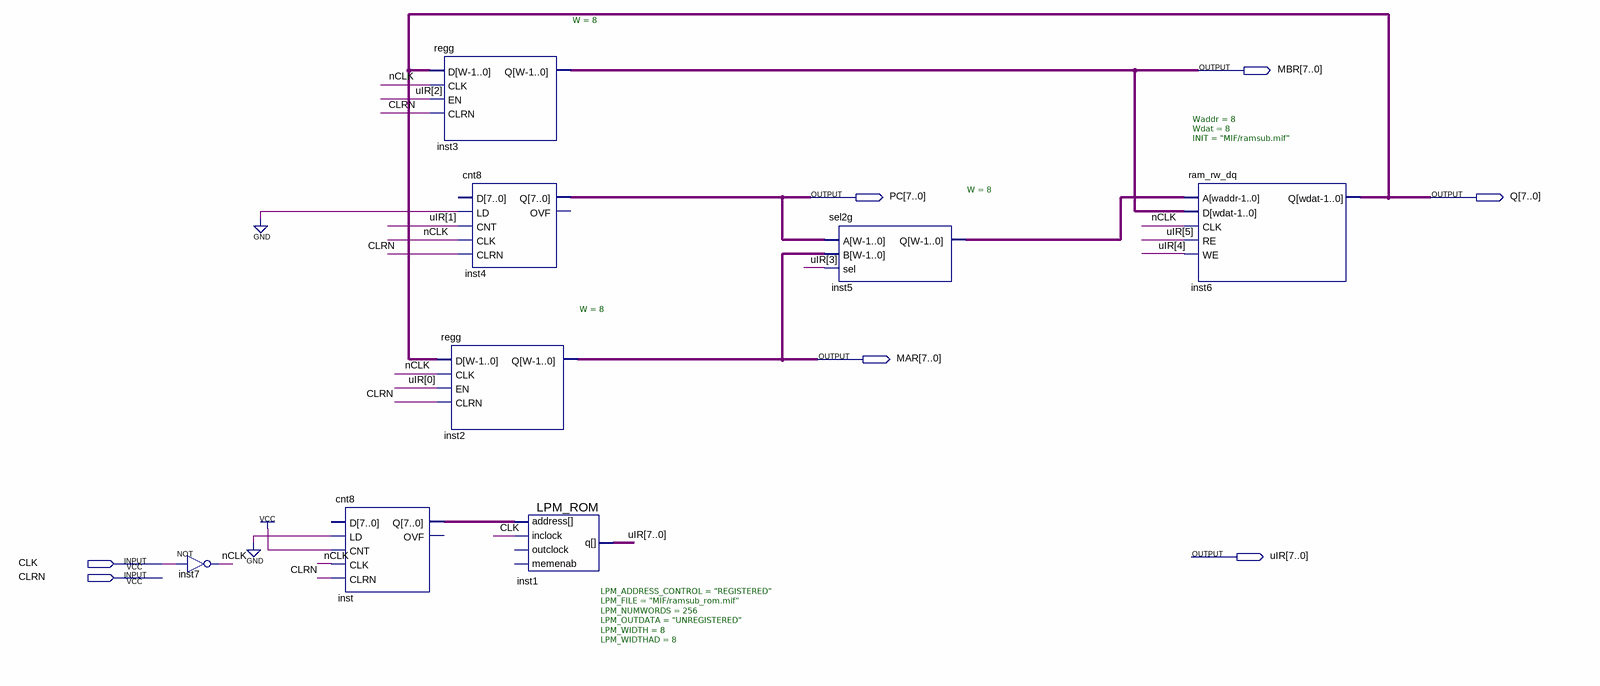
[diagram p0: schematic sheet]
// Quartus schematic ramsub.bdf as structural Verilog: 8 symbols, 7 pins
module ramsub (
  input  CLK,
  input  CLRN,
  output [7:0] MBR,
  output [7:0] PC,
  output [7:0] Q,
  output [7:0] MAR,
  output [7:0] uIR
);

  wire nCLK;
  wire [7:0] inst5_q, inst_q;

  not inst7 (nCLK, CLK);
  cnt8 inst (.LD(1'b0), .CNT(1'b1), .CLK(nCLK), .CLRN(CLRN), .Q(inst_q));  // open: D, OVF
  regg #(.W(8)) inst3 (.D(Q), .CLK(nCLK), .EN(uIR[2]), .CLRN(CLRN), .Q(MBR));
  cnt8 inst4 (.LD(1'b0), .CNT(uIR[1]), .CLK(nCLK), .CLRN(CLRN), .Q(PC));  // open: D, OVF
  regg #(.W(8)) inst2 (.D(Q), .CLK(nCLK), .EN(uIR[0]), .CLRN(CLRN), .Q(MAR));
  LPM_ROM #(.LPM_ADDRESS_CONTROL("REGISTERED"), .LPM_FILE("MIF/ramsub_rom.mif"), .LPM_NUMWORDS(256), .LPM_OUTDATA("UNREGISTERED"), .LPM_WIDTH(8), .LPM_WIDTHAD(8)) inst1 (
    .address(inst_q), .inclock(CLK), .q(uIR));  // open: outclock, memenab
  sel2g #(.W(8)) inst5 (.A(PC), .B(MAR), .sel(uIR[3]), .Q(inst5_q));
  ram_rw_dq #(.Waddr(8), .Wdat(8), .INIT("MIF/ramsub.mif")) inst6 (
    .A(inst5_q), .D(MBR), .CLK(nCLK), .RE(uIR[5]), .WE(uIR[4]), .Q(Q));
endmodule
